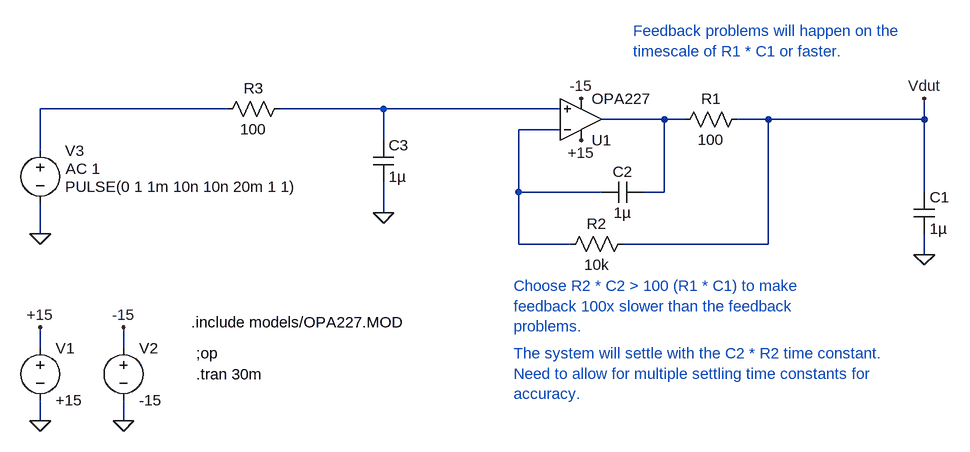
[diagram p0: schematic vdut_driver.asc]
vdut_driver.asc, the LTspice schematic file:
Version 4
SHEET 1 880 680
WIRE -1040 -192 -1328 -192
WIRE -800 -192 -960 -192
WIRE -528 -192 -800 -192
WIRE -368 -176 -464 -176
WIRE -336 -176 -368 -176
WIRE -208 -176 -256 -176
WIRE 32 -176 32 -208
WIRE 32 -176 -208 -176
WIRE -528 -160 -592 -160
WIRE -800 -144 -800 -192
WIRE -1328 -128 -1328 -192
WIRE -592 -64 -592 -160
WIRE -464 -64 -592 -64
WIRE -368 -64 -368 -176
WIRE -368 -64 -400 -64
WIRE 32 -64 32 -176
WIRE -800 -32 -800 -80
WIRE -1328 0 -1328 -48
WIRE -592 16 -592 -64
WIRE -512 16 -592 16
WIRE -208 16 -208 -176
WIRE -208 16 -432 16
WIRE 32 32 32 0
WIRE -1328 176 -1328 144
WIRE -1200 176 -1200 144
WIRE -1328 288 -1328 256
WIRE -1200 288 -1200 256
FLAG -1328 288 0
FLAG -1200 288 0
FLAG -1328 144 +15
FLAG -1200 144 -15
FLAG -496 -144 +15
FLAG -496 -208 -15
FLAG -1328 0 0
FLAG 32 32 0
FLAG 32 -208 Vdut
FLAG -800 -32 0
SYMBOL voltage -1328 160 R0
WINDOW 123 0 0 Left 2
WINDOW 39 0 0 Left 2
SYMATTR InstName V1
SYMATTR Value +15
SYMBOL voltage -1200 160 R0
WINDOW 123 0 0 Left 2
WINDOW 39 0 0 Left 2
SYMATTR InstName V2
SYMATTR Value -15
SYMBOL Opamps\\opamp2 -496 -112 M180
SYMATTR InstName U1
SYMATTR Value OPA227
SYMBOL res -352 -160 R270
WINDOW 0 32 56 VTop 2
WINDOW 3 0 56 VBottom 2
SYMATTR InstName R1
SYMATTR Value 100
SYMBOL res -528 32 R270
WINDOW 0 32 56 VTop 2
WINDOW 3 0 56 VBottom 2
SYMATTR InstName R2
SYMATTR Value 10k
SYMBOL cap -464 -48 R270
WINDOW 0 32 32 VTop 2
WINDOW 3 0 32 VBottom 2
SYMATTR InstName C2
SYMATTR Value 1µ
SYMBOL voltage -1328 -144 R0
WINDOW 123 39 44 Left 2
WINDOW 39 0 0 Left 2
WINDOW 0 38 16 Left 2
WINDOW 3 38 72 Left 2
SYMATTR Value2 AC 1
SYMATTR InstName V3
SYMATTR Value PULSE(0 1 1m 10n 10n 20m 1 1)
SYMBOL cap 16 -64 R0
SYMATTR InstName C1
SYMATTR Value 1µ
SYMBOL res -1056 -176 R270
WINDOW 0 32 56 VTop 2
WINDOW 3 0 56 VBottom 2
SYMATTR InstName R3
SYMATTR Value 100
SYMBOL cap -816 -144 R0
SYMATTR InstName C3
SYMATTR Value 1µ
TEXT -1096 136 Left 2 !.include models/OPA227.MOD
TEXT -1088 184 Left 2 !;op
TEXT -1088 216 Left 2 !.tran 30m
TEXT -416 -312 Left 2 ;Feedback problems will happen on the\ntimescale of R1 * C1 or faster.
TEXT -600 80 Left 2 ;Choose R2 * C2 > 100 (R1 * C1) to make\nfeedback 100x slower than the feedback\nproblems.
TEXT -600 184 Left 2 ;The system will settle with the C2 * R2 time constant.\nNeed to allow for multiple settling time constants for\naccuracy.

The netlist it stands for:
* vdut_driver.asc
V1 +15 0 +15
V2 -15 0 -15
XU1 N002 N004 +15 -15 N003 OPA227  ; pins In+ In- V+ V- OUT
R1 N003 Vdut 100
R2 N004 Vdut 10k
C2 N004 N003 1µ
V3 N001 0 PULSE(0 1 1m 10n 10n 20m 1 1) AC 1
C1 Vdut 0 1µ
R3 N001 N002 100
C3 N002 0 1µ
.include models/OPA227.MOD
;op
.tran 30m
* Feedback problems will happen on the
* timescale of R1 * C1 or faster.
* Choose R2 * C2 > 100 (R1 * C1) to make
* feedback 100x slower than the feedback
* problems.
* The system will settle with the C2 * R2 time constant.
* Need to allow for multiple settling time constants for
* accuracy.
.backanno
.end